# EAGLE design RGBstrip-ESP07-Controller-Amp-V1.2 (EAGLE 7.6.0)
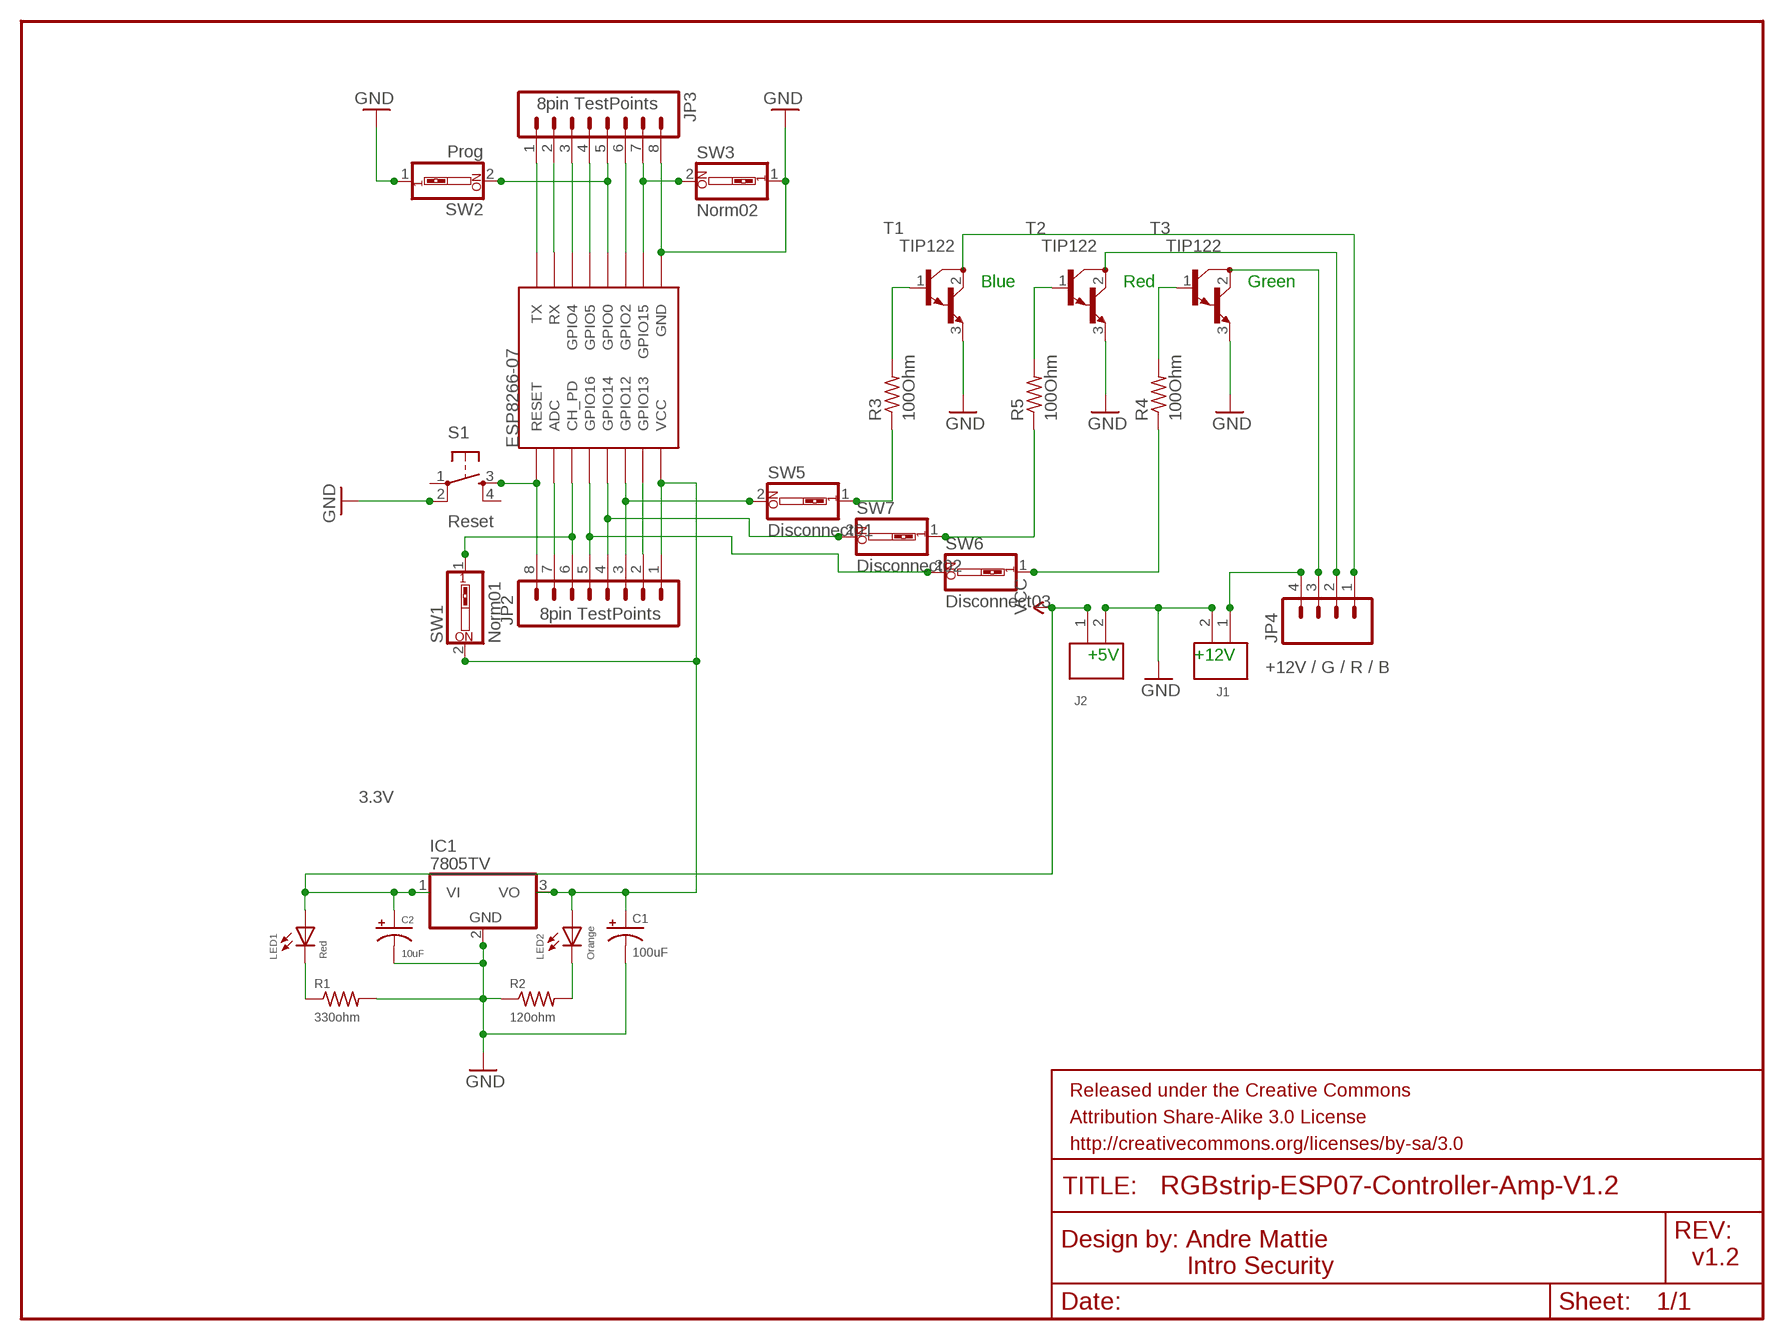
[diagram p0: schematic, sheet 1]

## Parts
C1  100uF  CAP_POLPTH1  [CPOL-RADIAL-100UF-25V]
C2  10uF  CAP_POLPTH2  [CPOL-RADIAL-10UF-25V]
ESP8266-07  ESP07-16PINBOTTOM  [ESP07-16PIN]
FRAME1  FRAME-LETTER  [CREATIVE_COMMONS]
IC1  7805TV  [TO220V]
J1  SCREW-TERMINAL_2_0.100  [CONN_BLOCK_2]
J2  SCREW-TERMINAL_2_0.100  [CONN_BLOCK_2]
JP2  8pin TestPoints  M08LONGPADS  [1X08_LONGPADS]
JP3  8pin TestPoints  M08LONGPADS  [1X08_LONGPADS]
JP4  +12V / G / R / B  M04LONGPADS  [1X04_LONGPADS]
LED1  Red  LED3MM  [LED3MM]
LED2  Orange  LED3MM  [LED3MM]
R1  330ohm  R-US_0309/V  [0309V]
R2  120ohm  R-US_0309/V  [0309V]
R3  100Ohm  R-US_0309/V  [0309V]
R4  100Ohm  R-US_0309/V  [0309V]
R5  100Ohm  R-US_0309/V  [0309V]
S1  Reset  TAC_SWITCHPTH  [TACTILE-PTH]
SW1  Norm01  SW_DIP-1  [EDG-01]
SW2  Prog  SW_DIP-1  [EDG-01]
SW3  Norm02  SW_DIP-1  [EDG-01]
SW5  Disconnect01  SW_DIP-1  [EDG-01]
SW6  Disconnect03  SW_DIP-1  [EDG-01]
SW7  Disconnect02  SW_DIP-1  [EDG-01]
T1  TIP122  [TO220]
T2  TIP122  [TO220]
T3  TIP122  [TO220]

## Nets
3.3V [3.3V]: C1.1(+) ESP8266-07.VCC IC1.3(VO) JP2.1 LED2.A SW1.2
BLUE-SUPPLY [Supply]: JP4.1 T1.2(C)
GND [GND]: C1.2(-) C2.2(-) ESP8266-07.GND IC1.2(GND) J1.2 J2.2 JP3.8 R1.2 R2.1 S1.2 SW2.1 SW3.1 T1.3(E) T2.3(E) T3.3(E)
GREEN [Signal]: ESP8266-07.GPIO16 JP2.5 SW6.2
GREEN-SUPPLY [Supply]: JP4.3 T3.2(C)
N$1: ESP8266-07.TX JP3.1
N$2: ESP8266-07.GPIO15 JP3.7 SW3.2
N$3: LED1.K(C) R1.1
N$4: LED2.K(C) R2.2
N$5: ESP8266-07.CH_PD JP2.6 SW1.1
N$6: R3.1 SW5.1
N$7: R4.1 SW6.1
N$8: ESP8266-07.RX JP3.2
N$9: ESP8266-07.GPIO0 JP3.5 SW2.2
N$10: R3.2 T1.1(B)
N$11: R5.1 SW7.1
N$12: ESP8266-07.GPIO4 JP3.3
N$13: ESP8266-07.GPIO5 JP3.4
N$15: ESP8266-07.GPIO2 JP3.6
N$18: ESP8266-07.REST(RESET) JP2.8 S1.3
N$19: R5.2 T2.1(B)
N$20: J1.1 JP4.4
N$21: R4.2 T3.1(B)
N$22: ESP8266-07.ADC JP2.7
N$26: ESP8266-07.GPIO12 JP2.3 SW5.2
N$27: ESP8266-07.GPIO13 JP2.2
RED [Signal]: ESP8266-07.GPIO14 JP2.4 SW7.2
RED-SUPPLY [Supply]: JP4.2 T2.2(C)
VCC: C2.1(+) IC1.1(VI) J2.1 LED1.A
Unconnected: S1.1 S1.4

## Notes on the sheet
- Blue | Red | Green
- +5V | +12V
- v1.2

## Library data of the parts
C1 C2 = SparkFun-Capacitors:CAP_POL: Capacitor Polarized These are standard SMD and PTH capacitors. Normally 10uF, 47uF, and 100uF in electrolytic and tantalum varieties. Always verify the external diameter of the through hole cap, it varies with capacity, voltage, and manufacturer. The EIA devices should be standard.
ESP8266-07 = ESP8266:ESP07-16PIN: ESP8266 Wifi module 07 - 16 pins
FRAME1 = Aesthetics:FRAME-LETTER: Schematic Frame Standard 8.5x11 US Letter frame
IC1 = linear:78*: Positive VOLTAGE REGULATOR Source: http://cache.national.com/ds/LM/LM78L05.pdf http://www.fairchildsemi.com/ds/LM/LM7805.pdf
J1 J2 = headers:SCREW-TERMINAL_2_0.100: 2x 0.100 in screw terminal block; DIGIKEY: 277-1273-ND; MOUSER: 651-1725656; NEWARK: 71C4107
JP2 JP3 = SparkFun-Connectors:M08: Header 8 Standard 8-pin 0.1" header. Use with straight break away headers (SKU : PRT-00116), right angle break away headers (PRT-00553), swiss pins (PRT-00743), machine pins (PRT-00117), and female headers (PRT-00115).
JP4 = SparkFun-Connectors:M04: Header 4 Standard 4-pin 0.1" header. Use with straight break away headers (SKU : PRT-00116), right angle break away headers (PRT-00553), swiss pins (PRT-00743), machine pins (PRT-00117), and female headers (PRT-00115). Molex polarized connector foot print use with SKU : PRT-08231 with associated crimp pins and housings. 1MM SMD Version SKU: PRT-10208
LED1 LED2 = adafruit:LED: LED OSRAM: - CHIPLED LG R971, LG N971, LY N971, LG Q971, LY Q971, LO R971, LY R971 LH N974, LH R974 LS Q976, LO Q976, LY Q976 LO Q996 - Hyper CHIPLED LW Q18S LB Q993, LB Q99A, LB R99A - SideLED LS A670, LO A670, LY A670, LG A670, LP A670 LB A673, LV A673, LT A673, LW A673 LH A674 LY A675 LS A676, LA A676, LO A676, LY A676, LW A676 LS A679, LY A679, LG A679 - Hyper Micro SIDELED® LS Y876, LA Y876, LO Y876, LY Y876 LT Y87S - SmartLED LW L88C, LW L88S LB L89C, LB L89S, LG L890 LS L89K, LO L89K, LY L89K LS L896, LA L896, LO L896, LY L896 - TOPLED LS T670, LO T670, LY T670, LG T670, LP T670 LSG T670, LSP T670, LSY T670, LOP T670, LYG T670 LG T671, LOG T671, LSG T671 LB T673, LV T673, LT T673, LW T673 LH T674 LS T676, LA T676, LO T676, LY T676, LB T676, LH T676, LSB T676, LW T676 LB T67C, LV T67C, LT T67C, LS T67K, LO T67K, LY T67K, LW E67C LS E67B, LA E67B, LO E67B, LY E67B, LB E67C, LV E67C, LT E67C LW T67C LS T679, LY T679, LG T679 LS T770, LO T770, LY T770, LG T770, LP T770 LB T773, LV T773, LT T773, LW T773 LH T774 LS E675, LA E675, LY E675, LS T675 LS T776, LA T776, LO T776, LY T776, LB T776 LHGB T686 LT T68C, LB T68C - Hyper Mini TOPLED® LB M676 - Mini TOPLED Santana® LG M470 LS M47K, LO M47K, LY M47K Source: http://www.osram.convergy.de/
R1-R5 = adafruit:R-US_: RESISTOR, American symbol
S1 = SparkFun-Electromechanical:TAC_SWITCH: Momentary Switch Button commonly used for reset or general input. Spark Fun Electronics SKU : COM-00097
SW1-SW3 SW5-SW7 = special:SW_DIP-1: DIP SWITCH
T1-T3 = transistor:TIP122: NPN BIPOLAR DARLINGTON TRANSISTOR

## Board
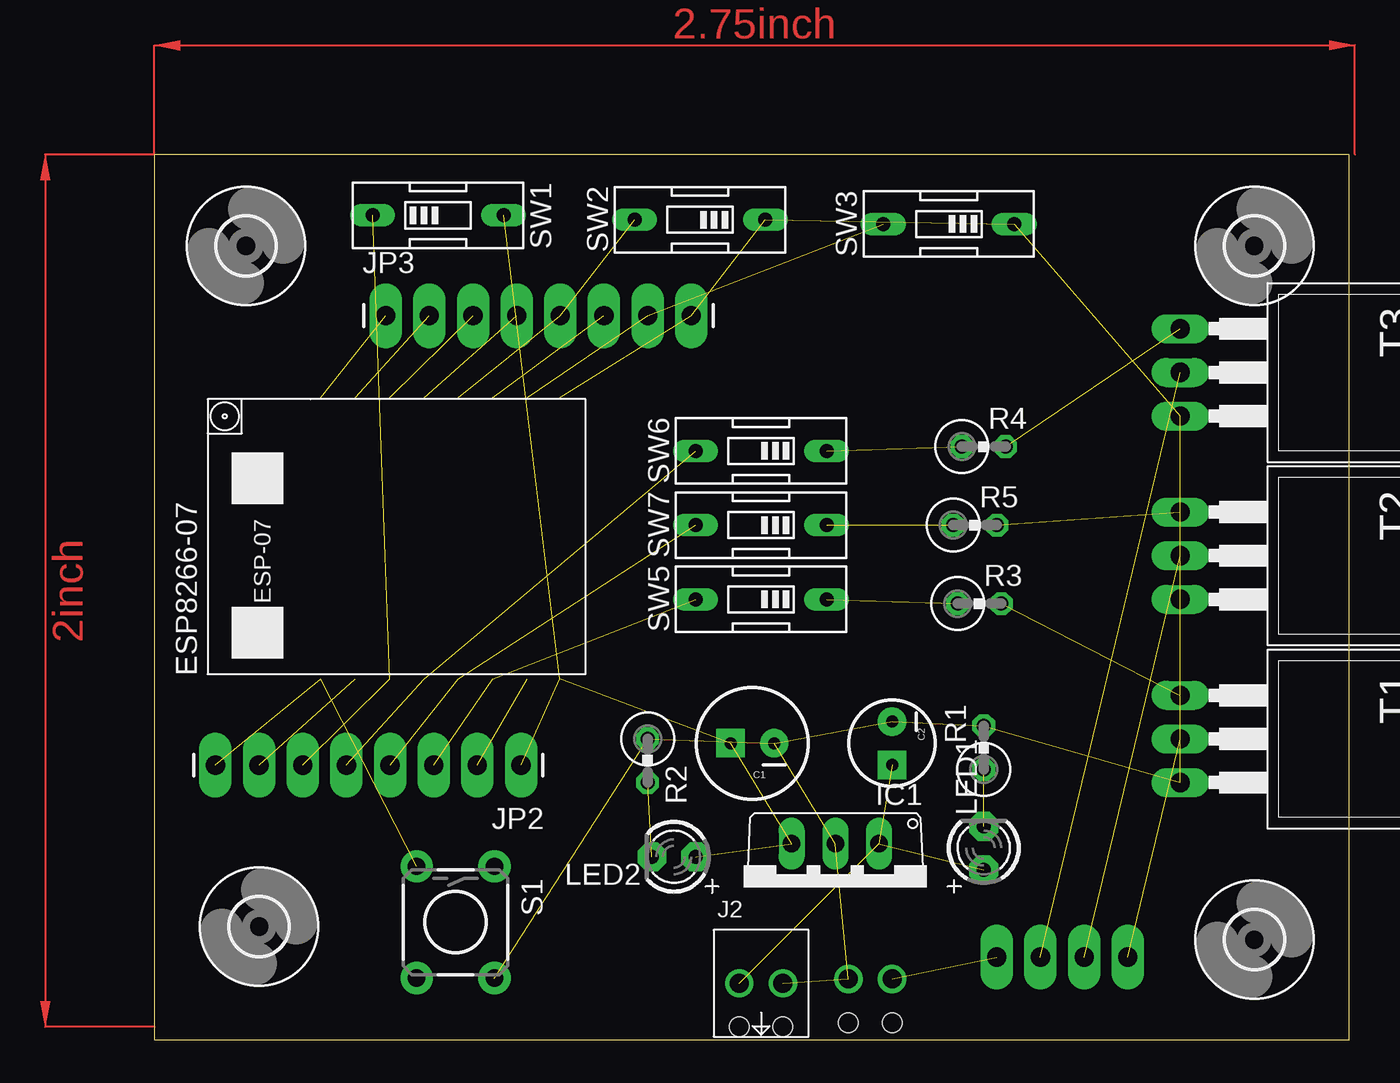
[diagram p1: board, top side]
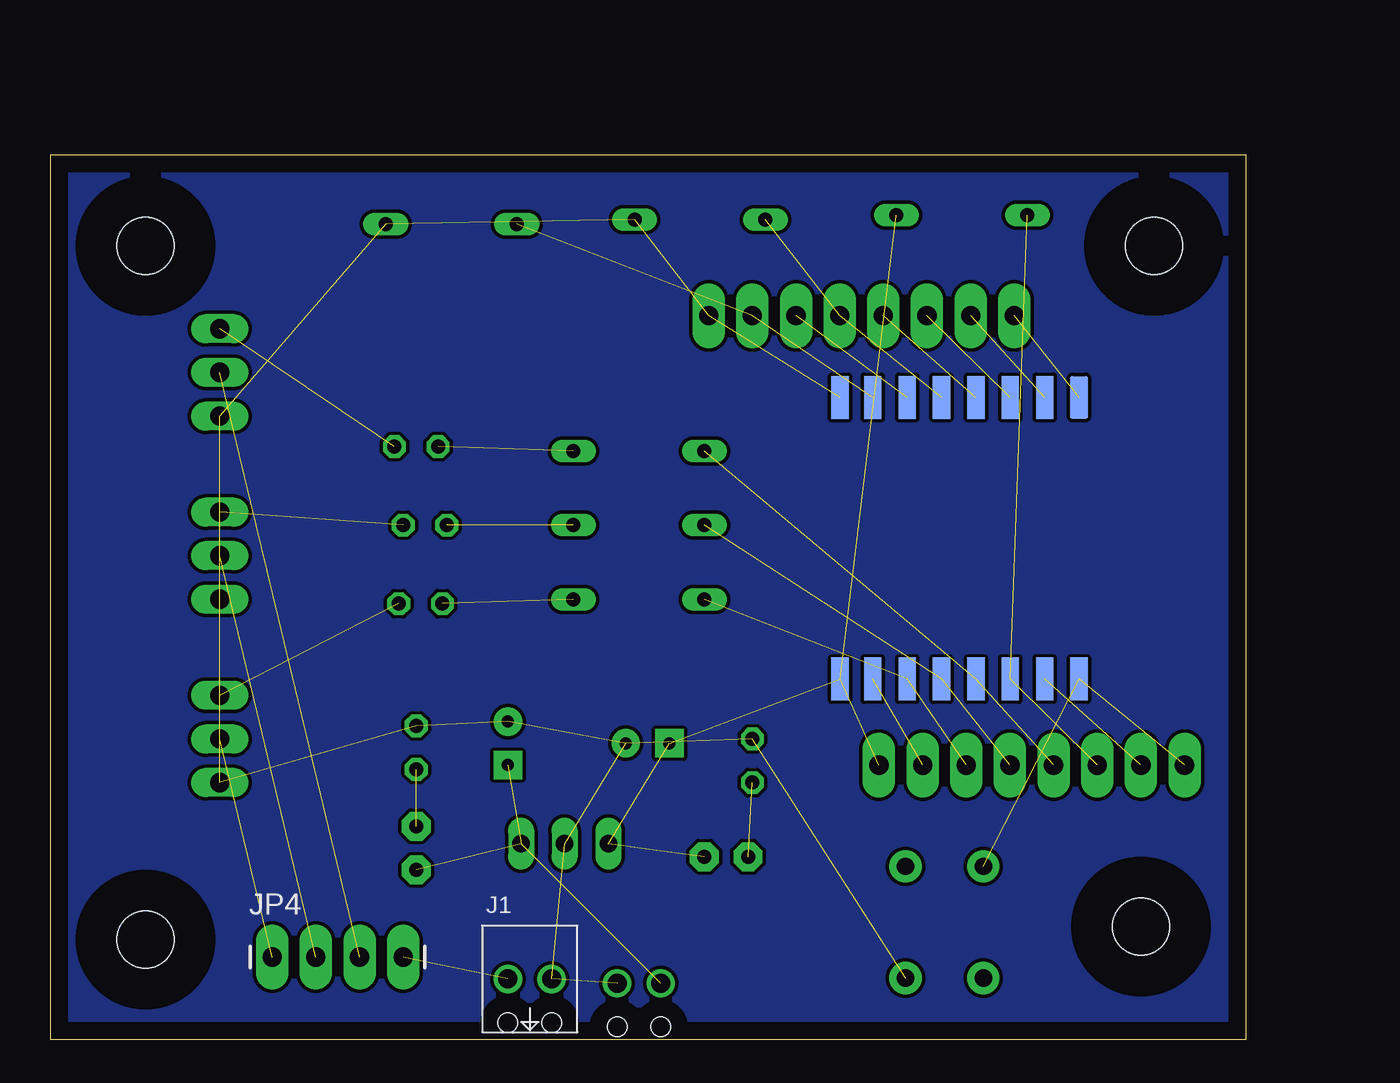
[diagram p2: board, bottom side, seen from below]

Size 69.52 x 51.55 mm. Coordinates in mm from the lower left corner, seen from the top.
Outline: 0,0 69.52,0 69.52,51.55 0,51.55 0,0
Copper layers (1*16): Top 0.035mm / dielectric 1.5mm / Bottom 0.035mm
Design rules "default": minimum track width 10mil, minimum drill 24mil, track to track 8mil, track to pad 8mil, pad to pad 8mil, via to via 8mil, smd to smd 8mil, copper to edge 40mil, drill to drill 8mil, minimum pad ring 10mil, minimum via ring 8mil, stop-mask expansion 4mil, vias tented up to drill 0mil, thermal gap 10mil

### Footprints (pad centres in the part's own frame; a part is rotated, then mirrored left to right if it is on the bottom)
CPOL-RADIAL-100UF-25V = drill 0.7 pad 1.651 square: 1 1.27,0 | drill 0.7 pad 1.651: 2 -1.27,0
CPOL-RADIAL-10UF-25V = drill 0.7 pad 1.651 square: 1 1.27,0 | drill 0.7 pad 1.651: 2 -1.27,0
ESP07-16PIN = smd 2.5 x 1 bottom: ADC -8.2,3.8; CH_PD -8.2,1.8; GND 8.2,-8.105; GPIO0 8.2,-2.2; GPIO2 8.2,-4.2; GPIO4 8.2,1.8; GPIO5 8.2,-0.2; GPIO12 -8.2,-4.2; GPIO13 -8.2,-6.2; GPIO14 -8.2,-2.2; GPIO15 8.2,-6.2; GPIO16 -8.2,-0.2; REST -8.2,5.8; RX 8.2,3.8; TX 8.2,5.8; VCC -8.2,-8.105
TO220V = drill 1.016 long: 1 -2.54,-2.54; 2 0,-2.54; 3 2.54,-2.54
CONN_BLOCK_2 = drill 1.1: 1 -1.27,0; 2 1.27,0 | hole 1.12: -1.27,-2.54; 1.27,-2.54
1X08_LONGPADS = drill 1.118 pad 1.88 long: 1 0,0; 2 2.54,0; 3 5.08,0; 4 7.62,0; 5 10.16,0; 6 12.7,0; 7 15.24,0; 8 17.78,0
1X04_LONGPADS = drill 1.118 pad 1.88 long: 1 0,0; 2 2.54,0; 3 5.08,0; 4 7.62,0
LED3MM = drill 0.813 pad 1.676 octagon: A -1.27,0; K 1.27,0
0309V = drill 0.813 octagon: 1 -1.27,0; 2 1.27,0
TACTILE-PTH = drill 1.016 pad 1.88: 1 -3.251,2.261; 2 3.251,2.261; 3 -3.251,-2.261; 4 3.251,-2.261
EDG-01 = drill 0.813 long: 1 0,-3.81; 2 0,3.81
TO220 = drill 1.118 long: 1 -2.54,-6.35; 2 0,-6.35; 3 2.54,-6.35 | hole 3.302: 0,11.176
3,3 = hole 3.3: 0,0

### Placement (x,y rotation side)
C1  34.8,17.27 180 top
C2  42.93,17.27 270 top
ESP8266-07  15.49,29.21 90 top
FRAME1  -77.47,40.13 0 top  (outside the outline)
IC1  39.62,8.89 180 top
J1  41.66,3.56 0 bottom
J2  35.31,3.3 0 top
JP2  21.34,16 180 top
JP3  13.46,42.16 0 top
JP4  56.64,4.83 0 bottom
LED1  48.26,11.18 90 top
LED2  30.23,10.67 180 top
R1  48.26,17.02 90 top
R2  28.7,16.26 270 top
R3  48.01,25.4 0 top
R4  48.26,34.54 0 top
R5  47.75,29.97 0 top
S1  17.53,6.86 270 top
SW1  16.51,48.01 270 top
SW2  31.75,47.75 90 top
SW3  46.23,47.5 90 top
SW5  35.31,25.65 90 top
SW6  35.31,34.29 90 top
SW7  35.31,29.97 90 top
T1  66.04,17.53 270 top
T2  66.04,28.19 270 top
T3  66.04,38.86 270 top
U$1  [3,3]  6.1,6.6 0 top
U$2  [3,3]  5.33,46.23 0 top
U$3  [3,3]  64.01,46.23 0 top
U$4  [3,3]  64.01,5.84 0 top

### Tracks (layer width: path | path; a pad name or v marks a point on that pad's centre or on a via)
3.3V  (5 unrouted)
BLUE-SUPPLY  (1 unrouted)
GND  (14 unrouted)
GND-PLANE
  pour Bottom: 0,51.56 69.34,51.56 69.34,-0.25 0,0.51
GREEN  (2 unrouted)
GREEN-SUPPLY  (1 unrouted)
N$1  (1 unrouted)
N$2  (2 unrouted)
N$3  (1 unrouted)
N$4  (1 unrouted)
N$5  (2 unrouted)
N$6  (1 unrouted)
N$7  (1 unrouted)
N$8  (1 unrouted)
N$9  (2 unrouted)
N$10  (1 unrouted)
N$11  (1 unrouted)
N$12  (1 unrouted)
N$13  (1 unrouted)
N$15  (1 unrouted)
N$18  (2 unrouted)
N$19  (1 unrouted)
N$20  (1 unrouted)
N$21  (1 unrouted)
N$22  (1 unrouted)
N$26  (2 unrouted)
N$27  (1 unrouted)
RED  (2 unrouted)
RED-SUPPLY  (1 unrouted)
VCC  (3 unrouted)
(copper drawn outside any net)
  shapes: Top area x2